# EAGLE design dual-voltage (EAGLE 6.4)
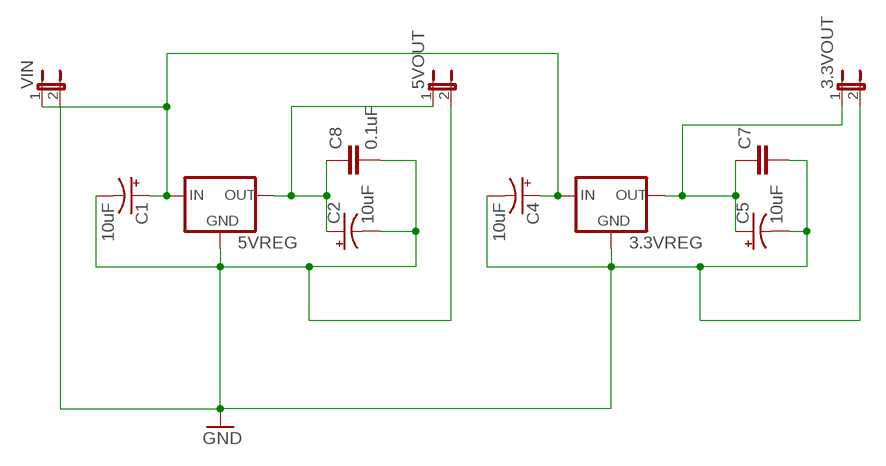
[diagram p0: schematic, sheet 1]

## Parts
3.3VOUT  JUMPER-2PTH  [1X02]
3.3VREG  78XXS  [78XXS]
5VOUT  JUMPER-2PTH  [1X02]
5VREG  78XXS  [78XXS]
C1  10uF  CAP_POLPTH2  [CPOL-RADIAL-10UF-25V]
C2  10uF  CAP_POLPTH2  [CPOL-RADIAL-10UF-25V]
C4  10uF  CAP_POLPTH2  [CPOL-RADIAL-10UF-25V]
C5  10uF  CAP_POLPTH2  [CPOL-RADIAL-10UF-25V]
C7  CAPPTH2  [CAP-PTH-SMALL2]
C8  0.1uF  CAPPTH2  [CAP-PTH-SMALL2]
VIN  JUMPER-2PTH  [1X02]

## Nets
3.3V: 3.3VOUT.1 3.3VREG.OUT C5.1(+) C7.1
5V: 5VOUT.1 5VREG.OUT C2.1(+) C8.1
GND: 3.3VOUT.2 3.3VREG.GND 5VOUT.2 5VREG.GND C1.2(-) C2.2(-) C4.2(-) C5.2(-) C7.2 C8.2 VIN.2
N$1: 3.3VREG.IN 5VREG.IN C1.1(+) C4.1(+) VIN.1

## Library data of the parts
3.3VOUT 5VOUT VIN = SparkFun-Passives:JUMPER-2: Jumper Basic 0.1" spaced jumper. Use with breakaway headers.
3.3VREG 5VREG = v-reg:78XXS: VOLTAGE REGULATOR
C1 C2 C4 C5 = SparkFun-Capacitors:CAP_POL: Capacitor Polarized These are standard SMD and PTH capacitors. Normally 10uF, 47uF, and 100uF in electrolytic and tantalum varieties. Always verify the external diameter of the through hole cap, it varies with capacity, voltage, and manufacturer. The EIA devices should be standard.
C7 C8 = SparkFun-Passives:CAP: Capacitor Standard 0603 ceramic capacitor, and 0.1" leaded capacitor.

## Net classes
0 default: width 0.305 mm, drill 0.508 mm, clearance 0.381 mm

## Board
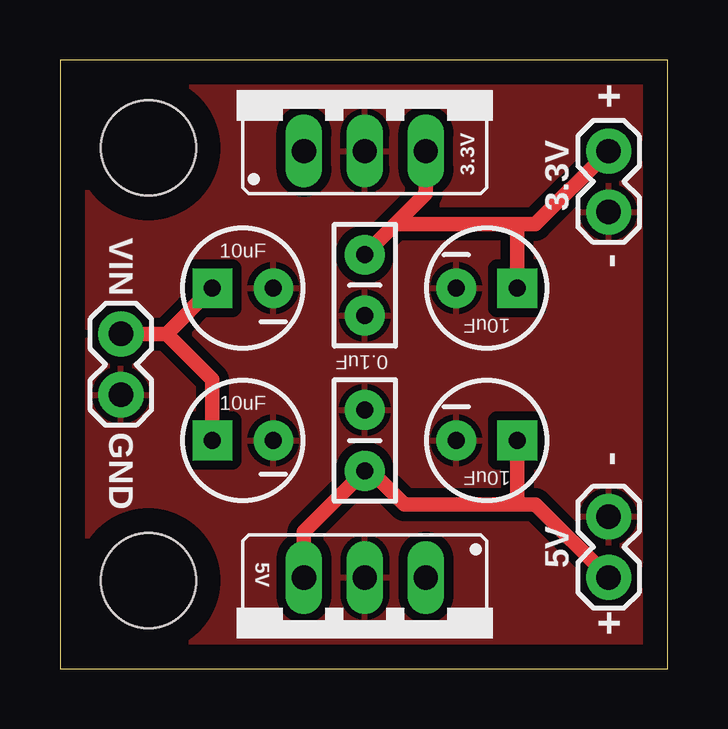
[diagram p1: board, top side]
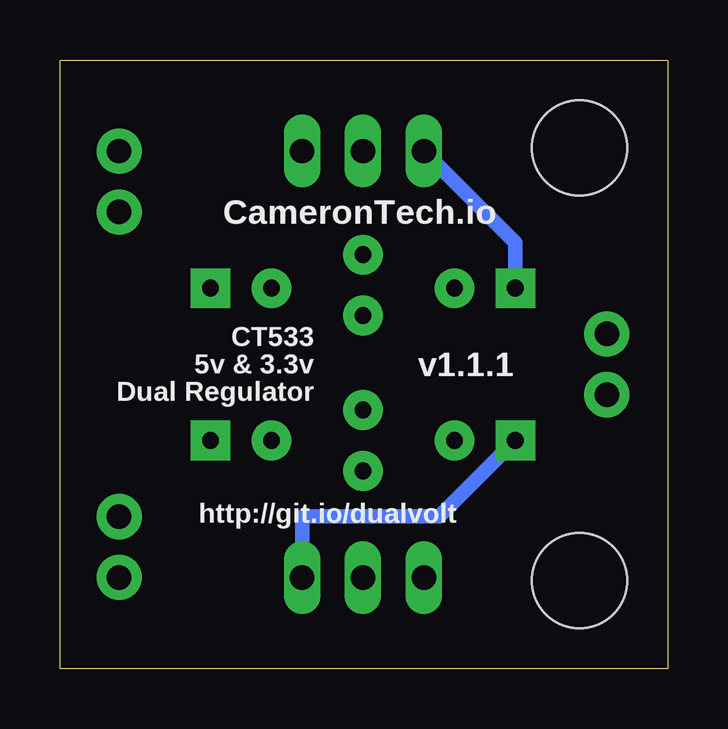
[diagram p2: board, bottom side, seen from below]

Size 25.32 x 25.39 mm. Coordinates in mm from the lower left corner, seen from the top.
Outline: 0,0 25.32,0 25.32,25.39 0,25.39 0,0
Copper layers (1*16): Top 0.035mm / dielectric 1.5mm / Bottom 0.035mm
Design rules "default": minimum track width 10mil, minimum drill 24mil, track to track 8mil, track to pad 8mil, pad to pad 8mil, via to via 8mil, smd to smd 8mil, copper to edge 40mil, drill to drill 8mil, minimum pad ring 10mil, minimum via ring 8mil, stop-mask expansion 4mil, vias tented up to drill 0mil, thermal gap 10mil
Holes 3.97 mm at 3.68,3.68 3.68,21.72

### Footprints (pad centres in the part's own frame; a part is rotated, then mirrored left to right if it is on the bottom)
1X02 = drill 1.016 pad 1.88: 1 0,0; 2 2.54,0
78XXS = drill 1.016 long: GND 0,-2.54; IN -2.54,-2.54; OUT 2.54,-2.54
CPOL-RADIAL-10UF-25V = drill 0.7 pad 1.651 square: 1 1.27,0 | drill 0.7 pad 1.651: 2 -1.27,0
CAP-PTH-SMALL2 = drill 0.7 pad 1.651: 1 0,0; 2 2.54,0

### Placement (x,y rotation side)
3.3VOUT  22.86,21.59 270 top
3.3VREG  12.7,24.13 0 top
5VOUT  22.86,3.81 90 top
5VREG  12.7,1.27 180 top
C1  7.62,15.88 180 top
C2  17.78,9.53 0 top
C4  7.62,9.53 180 top
C5  17.78,15.88 0 top
C7  12.7,17.27 270 top
C8  12.7,8.26 90 top
VIN  2.54,13.97 270 top

### Tracks (layer width: path | path; a pad name or v marks a point on that pad's centre or on a via)
3.3V
  Top 0.61: 3.3VREG.OUT 15.24,19.81 13.97,18.54 | 13.97,18.54 C7.1 | 19.05,18.54 19.81,18.54 3.3VOUT.1 | 19.05,18.54 13.97,18.54 | C5.1 19.05,18.54
5V
  Top 0.61: 5VREG.OUT 10.16,5.71 C8.1 12.95,8.26 14.35,6.86 19.05,6.86 | 19.05,6.86 19.81,6.86 5VOUT.1 | C2.1 19.05,6.86
GND
  pour Top: 0,25.4 0,0 25.4,0 25.4,25.4
N$1
  Top 0.61: VIN.1 4.45,13.97 | 4.45,13.97 C1.1 | 4.45,13.97 6.35,12.06 C4.1
  Bottom 0.61: C4.1 9.53,6.35 15.24,6.35 5VREG.IN | C1.1 6.35,17.78 3.3VREG.IN

### Text on the board
tNames: + | 3.3V | 3.3V | VIN | - | 0.1uF | - | GND | GND | 5V | 5V | +
bNames: CameronTech.io | CT533 | v1.1.1 | 5v & 3.3v | Dual Regulator | http://git.io/dualvolt